# EAGLE board RTK_Mosaic_X5 (EAGLE 9.6.2), part 1 of 2
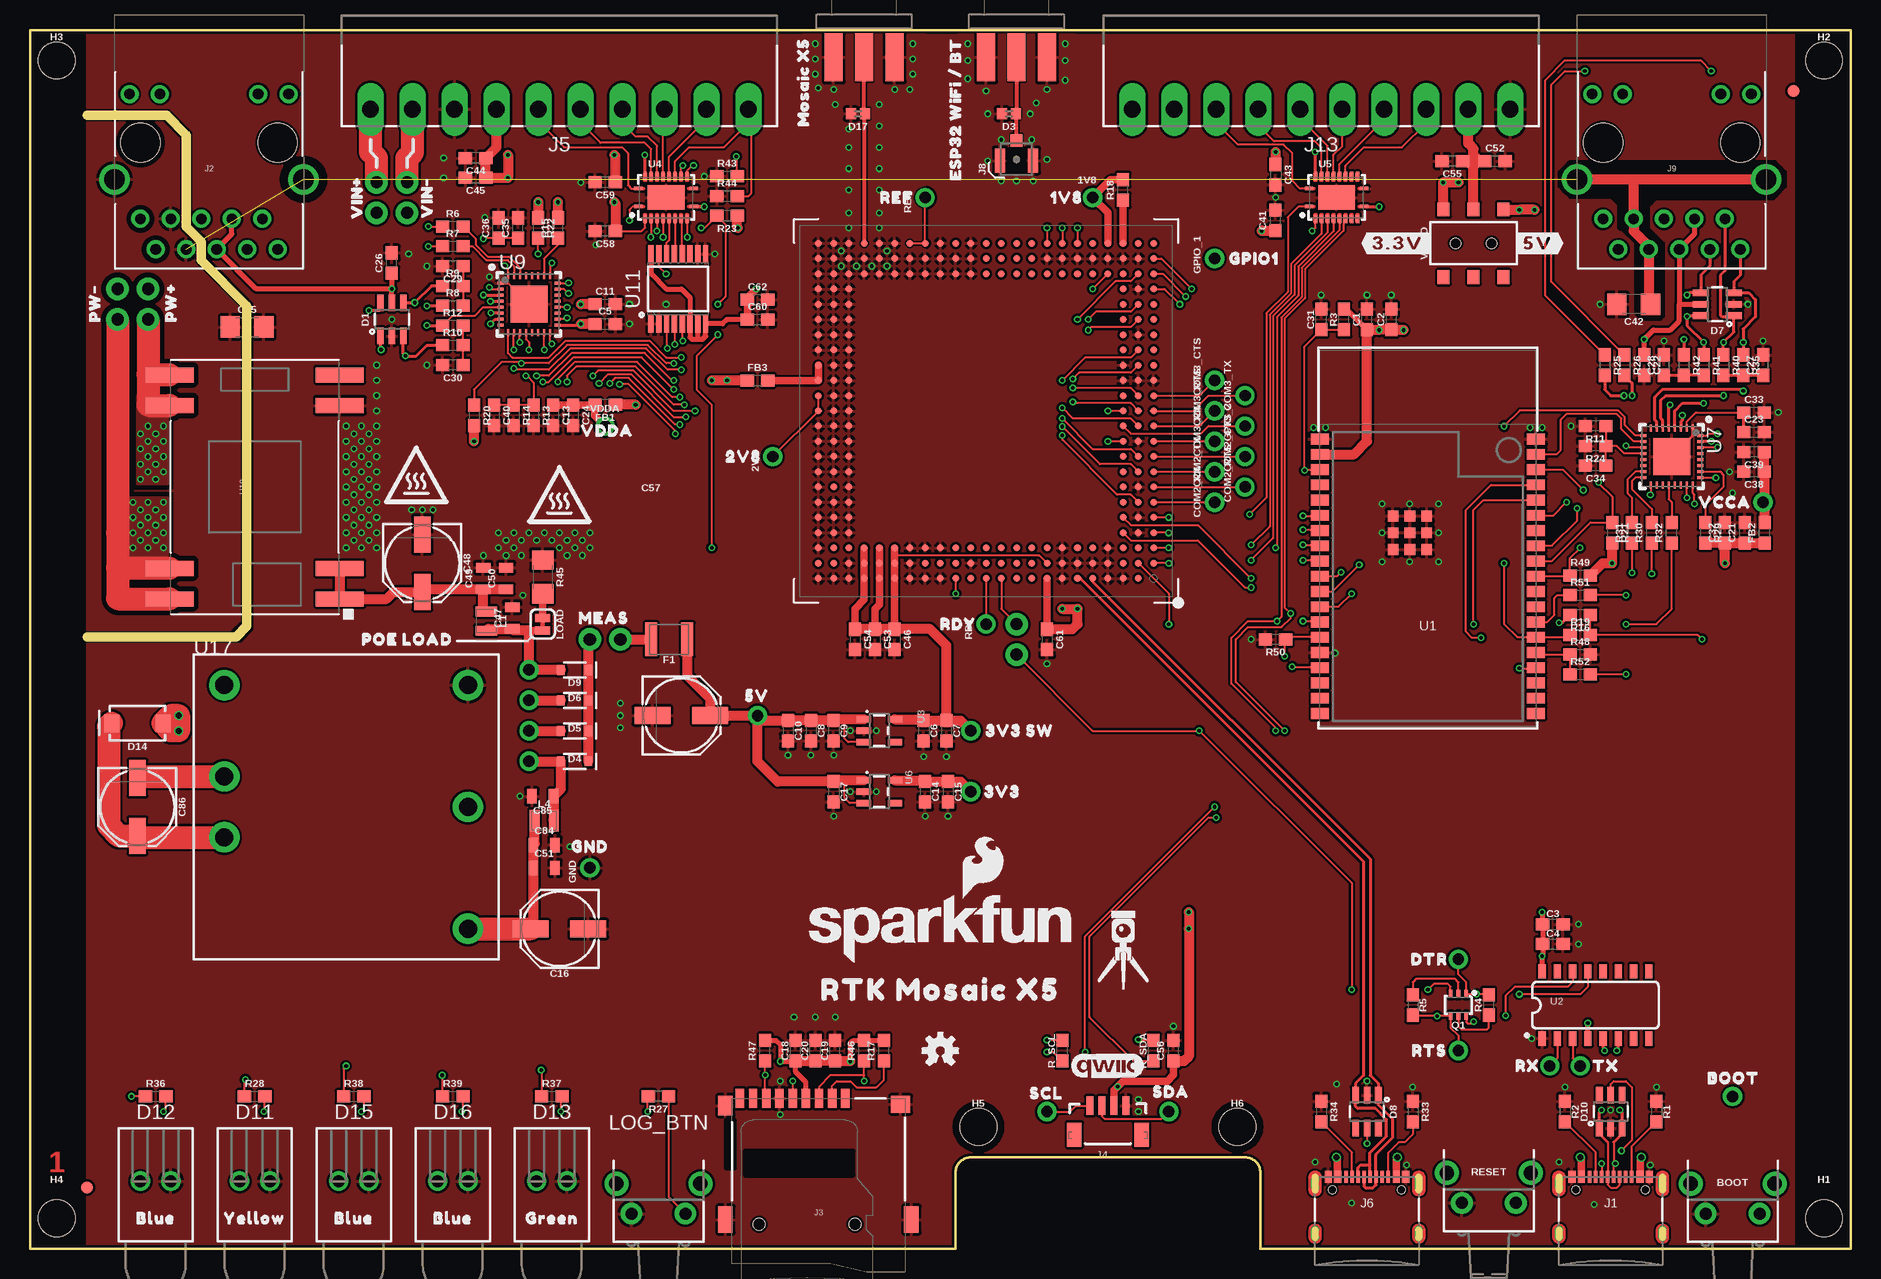
[diagram p2: board, top side]
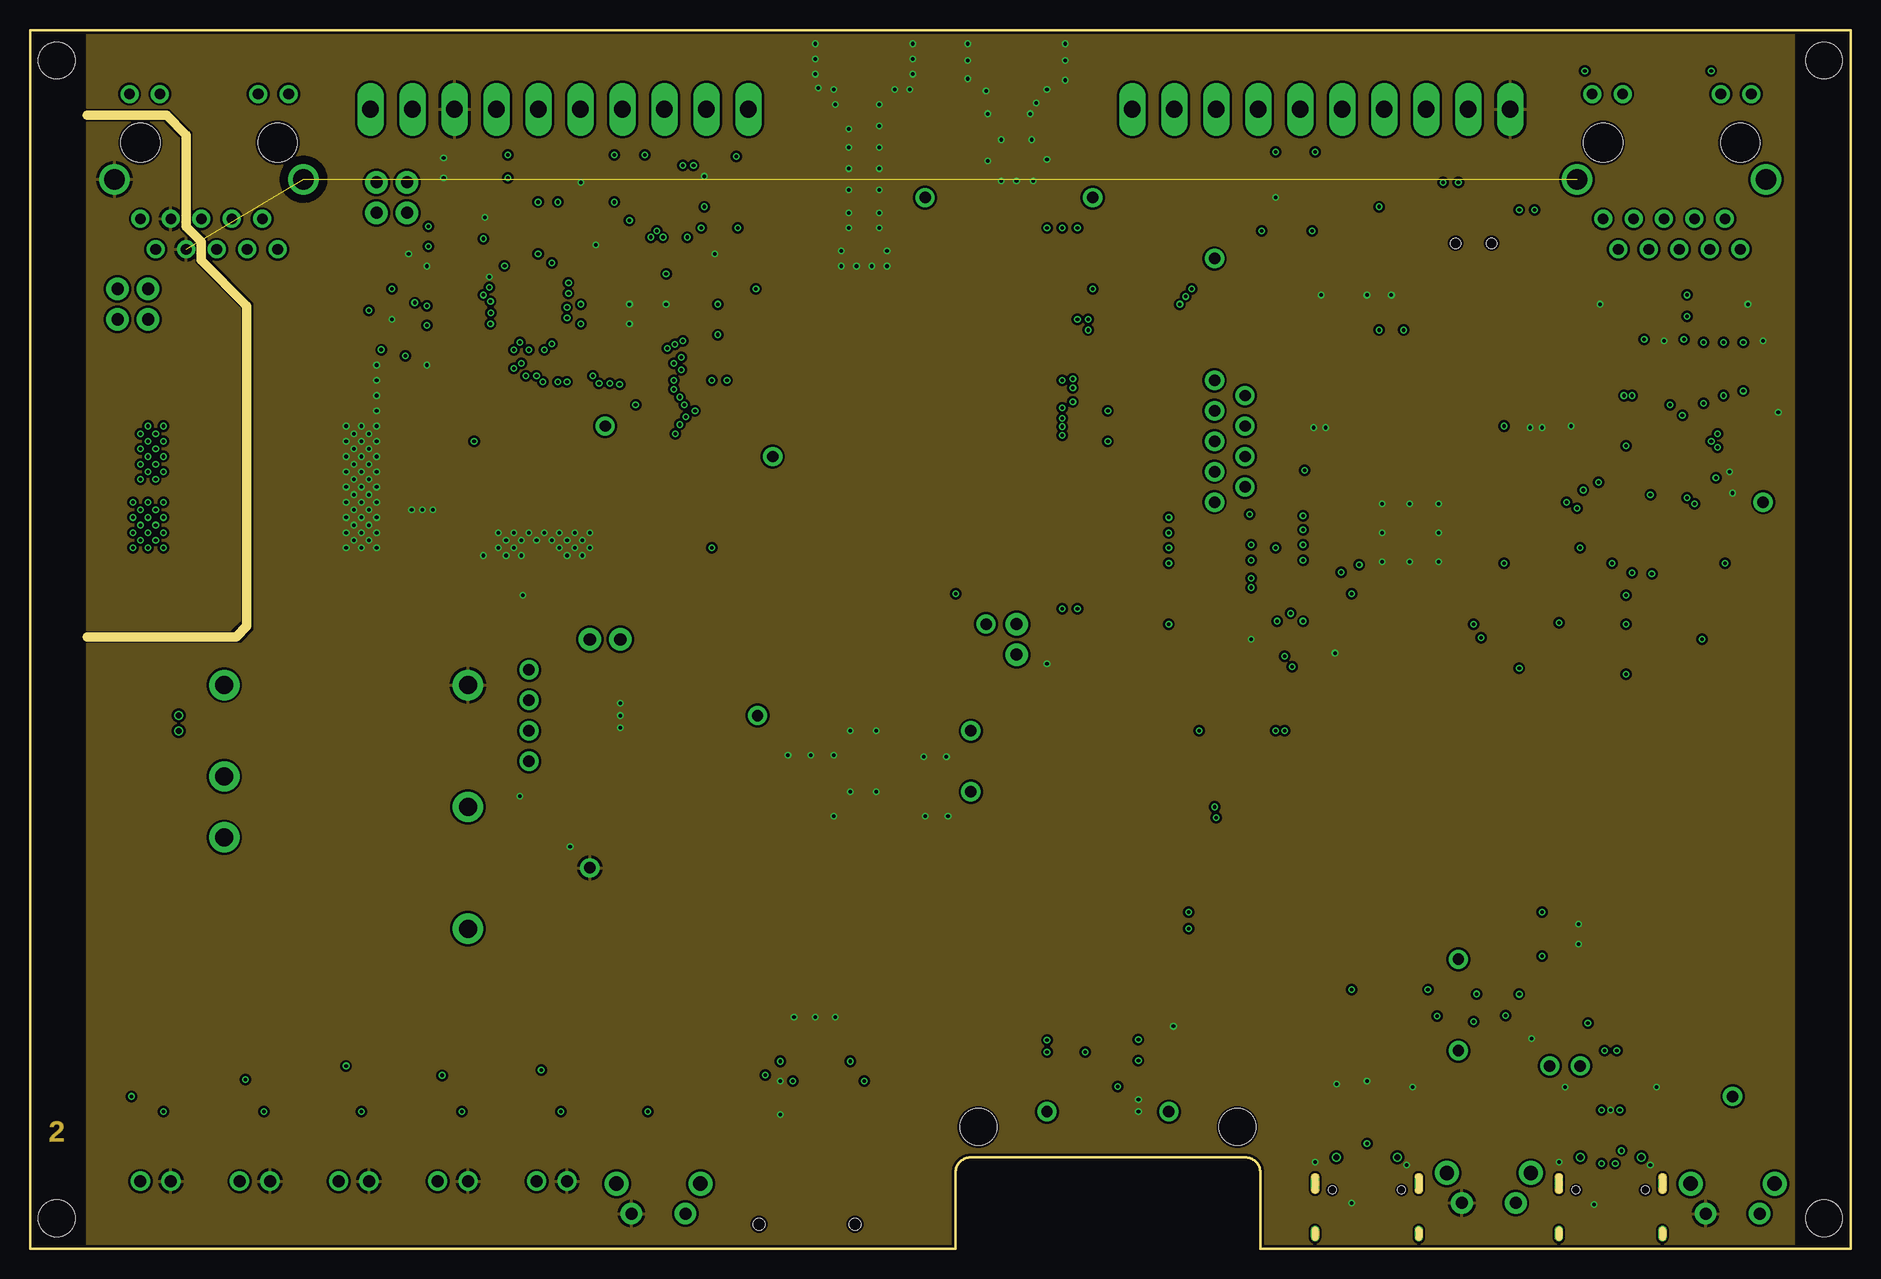
[diagram p3: board, inner layer Route2]
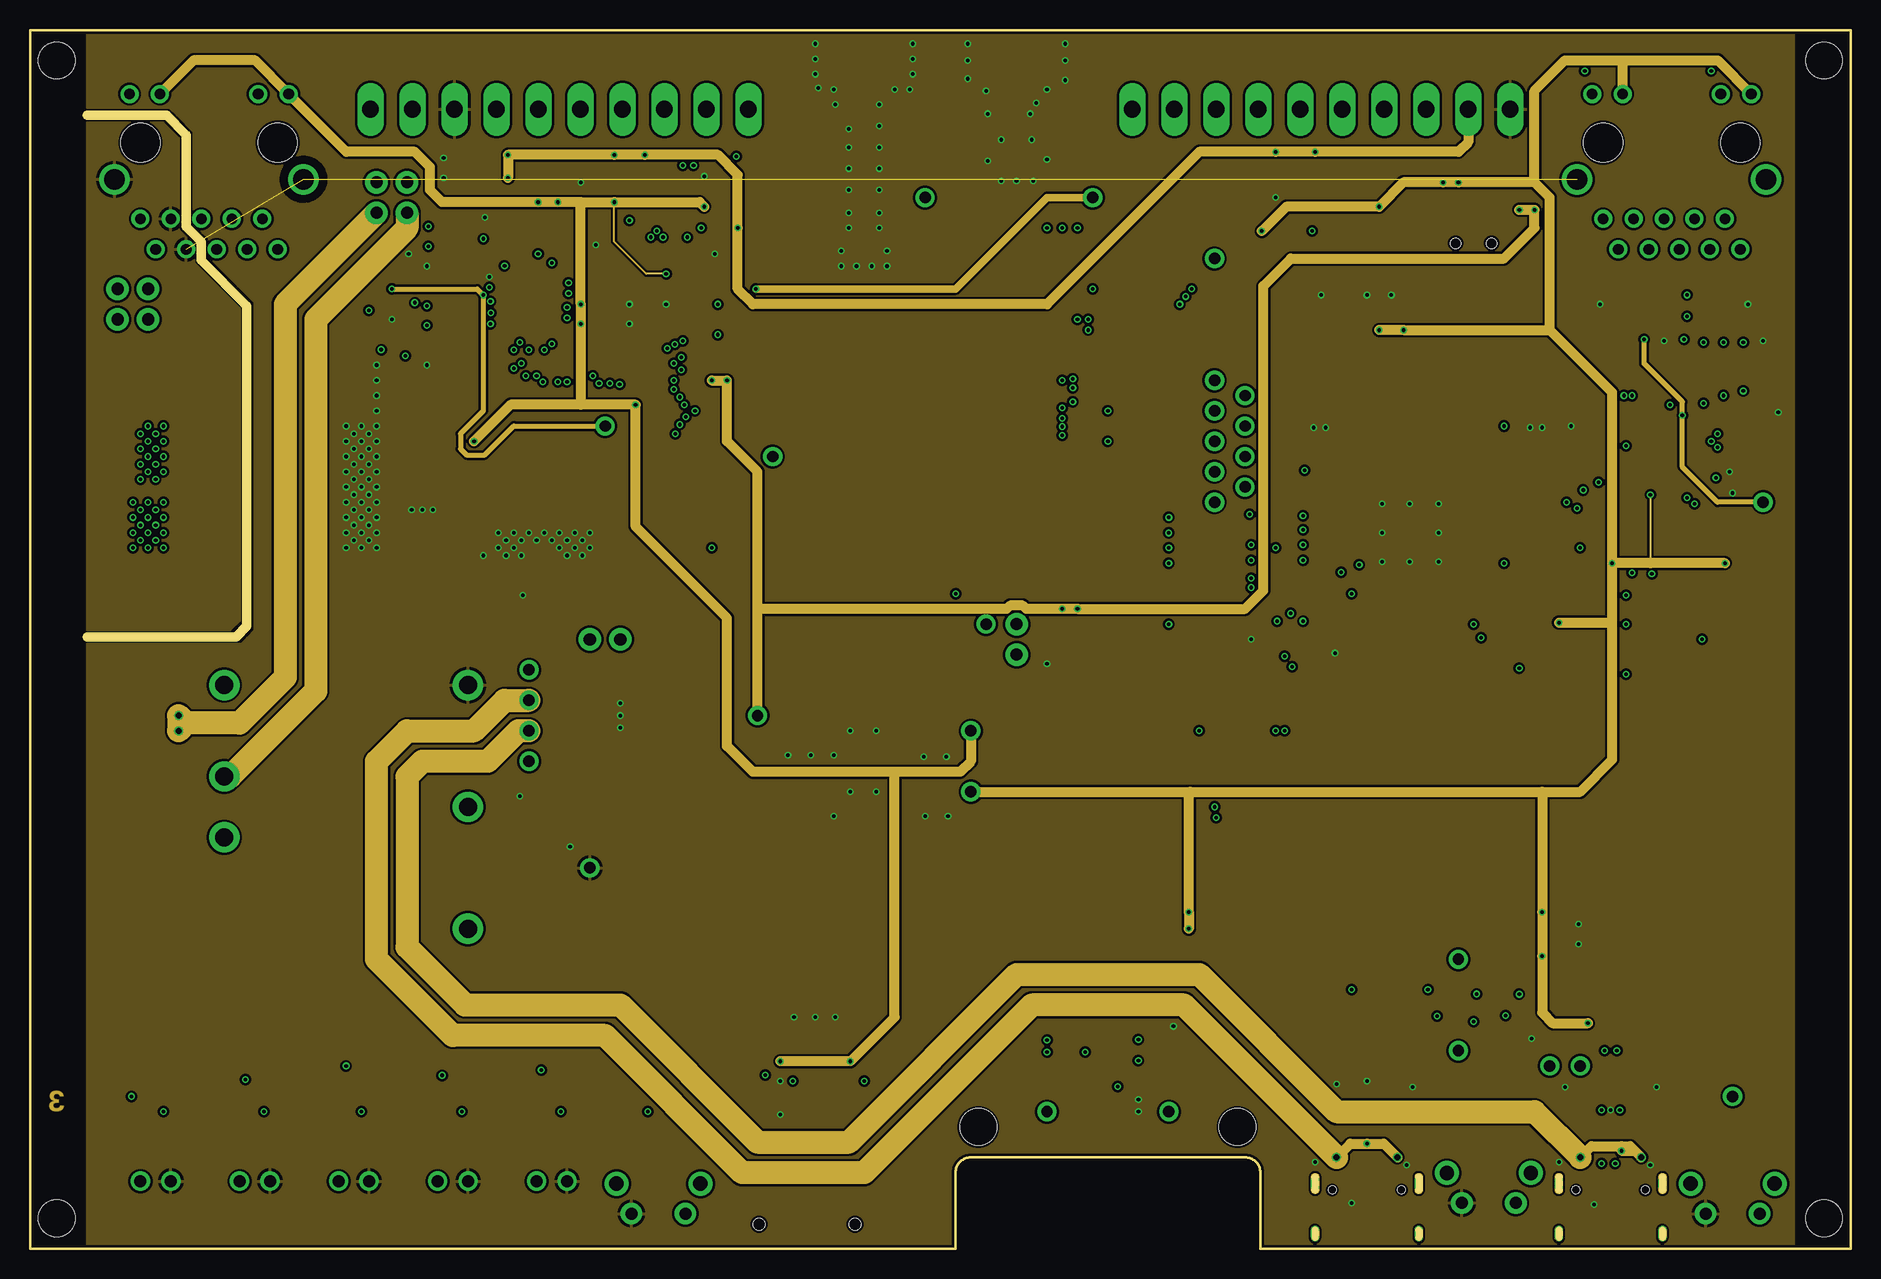
[diagram p4: board, inner layer Route15]
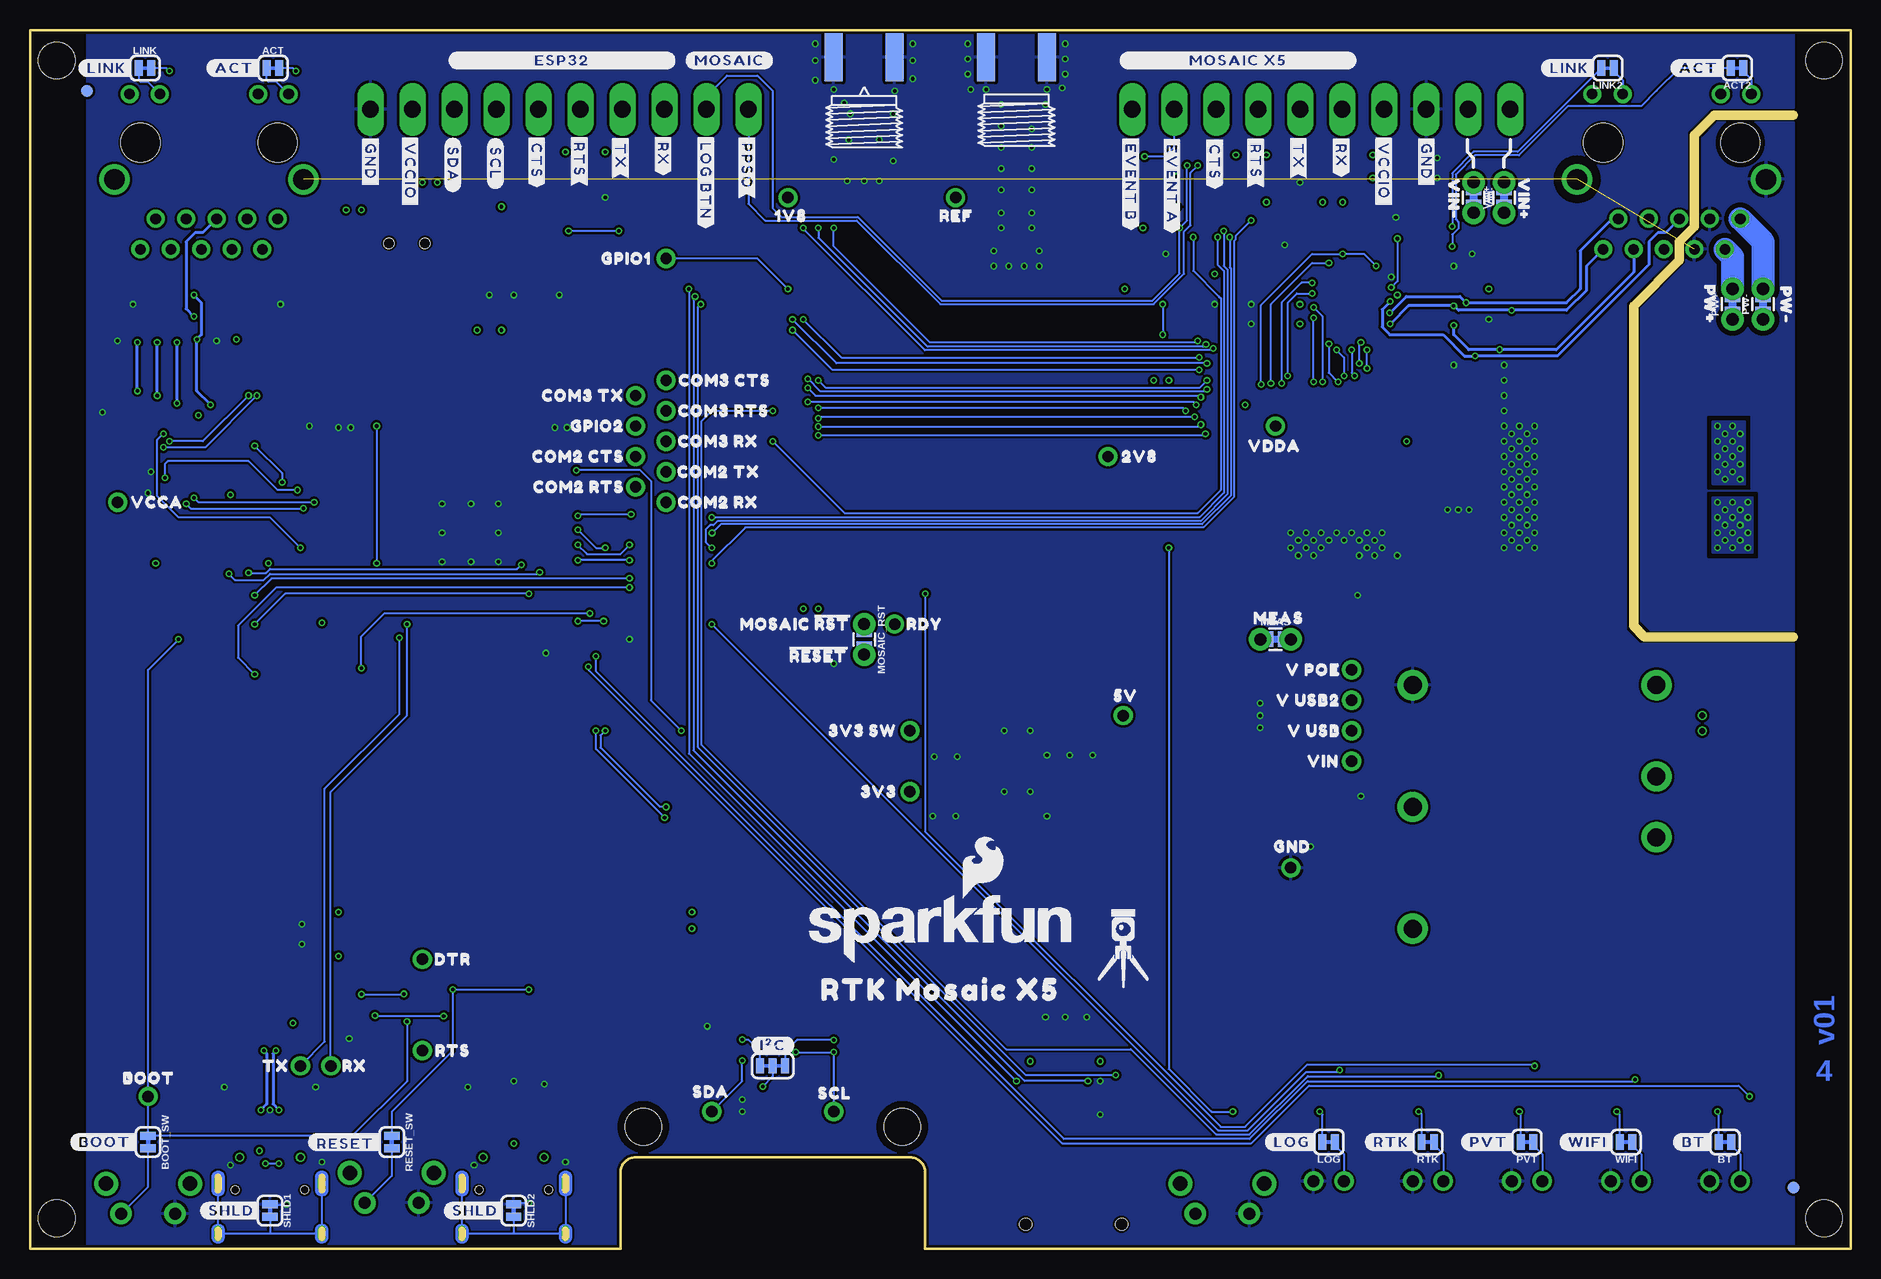
[diagram p5: board, bottom side, seen from below]

Size 151.77 x 101.6 mm. Coordinates in mm from the lower left corner, seen from the top.
Outline: 0,0 77.15,0 77.15,6.35 arc-90 78.42,7.62 101.28,7.62 arc-90 102.55,6.35 102.55,0 151.77,0 151.77,101.6 0,101.6 0,0
Copper layers (1*2*15*16): Top 0.035559375mm / dielectric 0.47751875mm / Route2 0.035559375mm / dielectric 0.47751875mm / Route15 0.035559375mm / dielectric 0.47751875mm / Bottom 0.035559375mm
Design rules "SparkFun-4-Layer-Minimum-JLCPCB": minimum track width 5mil, minimum drill 0.2mm, track to track 5mil, track to pad 5mil, pad to pad 5mil, via to via 5mil, smd to smd 5mil, copper to edge 7mil, drill to drill 7mil, minimum pad ring 5mil, minimum via ring 5mil, stop-mask expansion 2.5mil, vias tented up to drill 25mil, thermal gap 10mil
Net classes: 2 3.3V: width 0.508 mm; 3 RF_IN: width 0.35 mm, clearance 0.46 mm; 4 USB: width 0.203 mm, clearance 0.127 mm; 7 V_ZED: width 0.2 mm, clearance 0.2 mm; 8 V_RF: width 0.2 mm; 11 ZED_DIG: width 0.1 mm, clearance 0.1 mm
tKeepout: area 0,6.3 to 4.8,95.2; area 147,6.3 to 151.8,95.2
Milling: 9 lines

## Footprints (pad centres in the part's own frame; a part is rotated, then mirrored left to right if it is on the bottom)
1X01_NO_SILK = drill 0.95 pad 1.6: 1 0,0
SMT-JUMPER_2_NC_TRACE_SILK = smd 0.66 x 1.27: 1 -0.521,0; 2 0.521,0
TACTILE_SWITCH_PTH_RA_8-020 = drill 1 pad 1.8: 1 -2.25,0; 2 2.25,0 | drill 1.2 pad 2: M1 -3.5,2.5; M2 3.5,2.5
0603 = smd 1.1 x 1: 1 -0.85,0; 2 0.85,0
PANASONIC_D = smd 3 x 1.4: + 2.4,0; - -2.4,0
1206 = smd 1.6 x 1.8: 1 -1.4,0; 2 1.4,0
0805 = smd 0.8 x 1.2: 1 -0.9,0; 2 0.9,0
SOT-23-6 = smd 0.55 x 1.35: 1 -0.95,-1.375; 2 0,-1.375; 3 0.95,-1.375; 4 0.95,1.375; 5 0,1.375; 6 -0.95,1.375
0402 = smd 0.85 x 0.9: 1 -0.58,0; 2 0.58,0
SOD-323 = smd 0.63 x 0.83: A 1.15,0; C -1.15,0
CBI-RIGHT-ANGLE-PTH = drill 1 pad 1.6: A -1.27,5; C 1.27,5
SMA-DIODE = smd 1.27 x 1.47: A -2.15,0; C 2.15,0
RP-SMA-EDGE = smd 1.5 x 4: GND@0 -2.54,0; GND@1 2.54,0; SIG 0,0 | smd 1.5 x 4 bottom: GND@2 -2.54,0; GND@3 2.54,0
1210 = smd 1 x 2.8: 1 -1.5,0; 2 1.5,0
FIDUCIAL-1X2 = smd 1 x 1: 1 0,0
STAND-OFF-TIGHT = hole 3.048: 0,0
SMT-JUMPER_3_2-NC_TRACE_SILK = smd 0.66 x 1.27: 1 -1.041,0; 2 0,0; 3 1.041,0
USB-C-16P_4LAYER-PADS = smd 0.3 x 1: A5 -1.25,-0.34; A6 -0.25,-0.34; A7 0.25,-0.34; A8 1.25,-0.34; B5 1.75,-0.34; B6 0.75,-0.34; B7 -0.75,-0.34; B8 -1.75,-0.34 | smd 0.6 x 1: GND -3.225,-0.34; GND2 3.225,-0.34; VBUS1 -2.45,-0.34; VBUS2 2.45,-0.34 | drill 0.4 pad 0.6 long: SHLD1 -4.318,-0.915; SHLD2 4.318,-0.915; SHLD3 -4.318,-5.095; SHLD4 4.318,-5.095 | hole 0.65: -2.89,-1.445; 2.89,-1.445
MAGJACK-SYM_LED = drill 0.9 pad 1.5: 1 -5.715,8.89; 2 -4.445,6.35; 3 -3.175,8.89; 4 -1.905,6.35; 5 -0.635,8.89; 6 0.635,6.35; 7 1.905,8.89; 8 3.175,6.35; 9 4.445,8.89; 10 5.715,6.35; 11 -6.63,-4.06; 12 -4.09,-4.06; 13 4.09,-4.06; 14 6.63,-4.06 | drill 1.7 pad 2.4: S1 -7.875,3.05; S2 7.875,3.05 | hole 3.25: -5.715,0; 5.715,0
MICROSD-EXTERNALPIN = smd 0.7 x 1.6: 1 2.25,10.5; 2 1.15,10.5; 3 0.05,10.5; 4 -1.05,10.5; 5 -2.15,10.5; 6 -3.25,10.5; 7 -4.35,10.5; 8 -5.45,10.5; 9 -6.55,10.5 | smd 1.2 x 1.6: 10 -7.75,9.9 | smd 1.2 x 2.2: 11 -7.75,0.4; 12 7.75,0.4 | smd 1.6 x 1.4: 13 6.85,10 | hole 1: 3.05,0; -4.95,0
JST04_1MM_VERT = smd 0.6 x 1.55: 1 -1.5,0.775; 2 -0.5,0.775; 3 0.5,0.775; 4 1.5,0.775 | smd 1.2 x 2: NC1 -2.8,3.2; NC2 2.8,3.2
1X10_SCREW_TERMINAL_3.5MM = drill 1.4 pad 2.2 long: 1 -15.75,2.8; 2 -12.25,2.8; 3 -8.75,2.8; 4 -5.25,2.8; 5 -1.75,2.8; 6 1.75,2.8; 7 5.25,2.8; 8 8.75,2.8; 9 12.25,2.8; 10 15.75,2.8
U.FL_REDUCED_FOOTPRINT = smd 2 x 0.85: 1 -0.1,1.375; 2 -0.1,-1.375 | smd 1.05 x 1: FEED 1.575,0
0805-WIDE = smd 0.8 x 1.8: 1 -0.8,0; 2 0.8,0
COMBO-JUMPER_2_NC_TRACE = smd 0.635 x 1.27: 1 -0.508,0; 2 0.508,0 | drill 1.016 pad 1.88: 3 -1.27,0; 4 1.27,0
SMA-EDGE = smd 1.5 x 4: GND@0 -2.54,0; GND@1 2.54,0; SIG 0,0 | smd 1.5 x 4 bottom: GND@2 -2.54,0; GND@3 2.54,0
COMBO-JUMPER_2_NO = smd 0.635 x 1.27: 1 -0.508,0; 2 0.508,0 | drill 1.016 pad 1.88: 3 -1.27,0; 4 1.27,0
SC70-6 = smd 0.3 x 0.66: 1 -0.65,-0.92; 2 0,-0.92; 3 0.65,-0.92; 4 0.65,0.92; 5 0,0.92; 6 -0.65,0.92
ESP32-WROVER-E/IE = smd 0.9 x 1.5: 1 7.8,9; 2 6.53,9; 3 5.26,9; 4 3.99,9; 5 2.72,9; 6 1.45,9; 7 0.18,9; 8 -1.09,9; 9 -2.36,9; 10 -3.63,9; 11 -4.9,9; 12 -6.17,9; 13 -7.44,9; 14 -8.71,9; 15 -9.98,9; 16 -11.25,9; 17 -12.52,9; 18 -13.79,9; 19 -15.06,9; 20 -15.06,-9; 21 -13.79,-9; 22 -12.52,-9; 23 -11.25,-9; 24 -9.98,-9; 25 -8.71,-9; 26 -7.44,-9; 27 -6.17,-9; 28 -4.9,-9; 29 -3.63,-9; 30 -2.36,-9; 31 -1.09,-9; 32 0.18,-9; 33 1.45,-9; 34 2.72,-9; 35 3.99,-9; 36 5.26,-9; 37 6.53,-9; 38 7.8,-9 | smd 0.9 x 0.9: GND 0,1.5; GNDT1 -1.4,2.9; GNDT2 -1.4,1.5; GNDT3 -1.4,0.1; GNDT4 0,0.1; GNDT5 1.4,0.1; GNDT6 1.4,1.5; GNDT7 1.4,2.9; GNDT8 0,2.9
SO016 = smd 0.6 x 1.2: 1 -4.445,-2.8; 2 -3.175,-2.8; 3 -1.905,-2.8; 4 -0.635,-2.8; 5 0.635,-2.8; 6 1.905,-2.8; 7 3.175,-2.8; 8 4.445,-2.8; 9 4.445,2.8; 10 3.175,2.8; 11 1.905,2.8; 12 0.635,2.8; 13 -0.635,2.8; 14 -1.905,2.8; 15 -3.175,2.8; 16 -4.445,2.8
SOT23-5 = smd 0.55 x 1.2: 1 -0.95,-1.3; 2 0,-1.3; 3 0.95,-1.3; 4 0.95,1.3; 5 -0.95,1.3
VFQFN-20 = smd 0.7 x 0.28: 1 -2.3,-0.75; 10 2.3,-0.75; 11 2.3,0.75; 20 -2.3,0.75 | smd 0.28 x 0.7: 2 -1.75,-1.8; 3 -1.25,-1.8; 4 -0.75,-1.8; 5 -0.25,-1.8; 6 0.25,-1.8; 7 0.75,-1.8; 8 1.25,-1.8; 9 1.75,-1.8; 12 1.75,1.8; 13 1.25,1.8; 14 0.75,1.8; 15 0.25,1.8; 16 -0.25,1.8; 17 -0.75,1.8; 18 -1.25,1.8; 19 -1.75,1.8 | smd 3.05 x 2.05: EPAD 0,0
MLF55Q-32LD = smd 0.55 x 0.23: 1 -2.375,1.75; 2 -2.375,1.25; 3 -2.375,0.75; 4 -2.375,0.25; 5 -2.375,-0.25; 6 -2.375,-0.75; 7 -2.375,-1.25; 8 -2.375,-1.75; 17 2.375,-1.75; 18 2.375,-0.25; 19 2.375,-0.75; 20 2.375,-1.25; 21 2.375,0.25; 22 2.375,0.75; 23 2.375,1.25; 24 2.375,1.75 | smd 0.23 x 0.55: 9 -1.75,-2.375; 10 -0.25,-2.375; 11 -0.75,-2.375; 12 -1.25,-2.375; 13 0.25,-2.375; 14 0.75,-2.375; 15 1.25,-2.375; 16 1.75,-2.375; 25 1.75,2.375; 26 0.25,2.375; 27 0.75,2.375; 28 1.25,2.375; 29 -0.25,2.375; 30 -0.75,2.375; 31 -1.25,2.375; 32 -1.75,2.375 | smd 3.1 x 3.1: GND 0,0
MOSAIC_LGA = smd 0.6 x 0.6: A2 13.97,12.7; A3 13.97,11.43; A4 13.97,10.16; A5 13.97,8.89; A6 13.97,7.62; A7 13.97,6.35; A8 13.97,5.08; A9 13.97,3.81; A10 13.97,2.54; A11 13.97,1.27; A12 13.97,0; A13 13.97,-1.27; A14 13.97,-2.54; A15 13.97,-3.81; A16 13.97,-5.08; A17 13.97,-6.35; A18 13.97,-7.62; A19 13.97,-8.89; A20 13.97,-10.16; A21 13.97,-11.43; A22 13.97,-12.7; A23 13.97,-13.97; AA1 -11.43,13.97; AA2 -11.43,12.7; AA3 -11.43,11.43; AA4 -11.43,10.16; AA5 -11.43,8.89; AA6 -11.43,7.62; AA7 -11.43,6.35; AA8 -11.43,5.08; AA9 -11.43,3.81; AA10 -11.43,2.54; AA11 -11.43,1.27; AA12 -11.43,0; AA13 -11.43,-1.27; AA14 -11.43,-2.54; AA15 -11.43,-3.81; AA16 -11.43,-5.08; AA17 -11.43,-6.35; AA18 -11.43,-7.62; AA19 -11.43,-8.89; AA20 -11.43,-10.16; AA21 -11.43,-11.43; AA22 -11.43,-12.7; AA23 -11.43,-13.97; AB1 -12.7,13.97; AB2 -12.7,12.7; AB3 -12.7,11.43; AB4 -12.7,10.16; AB5 -12.7,8.89; AB6 -12.7,7.62; AB7 -12.7,6.35; AB8 -12.7,5.08; AB9 -12.7,3.81; AB10 -12.7,2.54; AB11 -12.7,1.27; AB12 -12.7,0; AB13 -12.7,-1.27; AB14 -12.7,-2.54; AB15 -12.7,-3.81; AB16 -12.7,-5.08; AB17 -12.7,-6.35; AB18 -12.7,-7.62; AB19 -12.7,-8.89; AB20 -12.7,-10.16; AB21 -12.7,-11.43; AB22 -12.7,-12.7; AB23 -12.7,-13.97; AC1 -13.97,13.97; AC2 -13.97,12.7; AC3 -13.97,11.43; AC4 -13.97,10.16; AC5 -13.97,8.89; AC6 -13.97,7.62; AC7 -13.97,6.35; AC8 -13.97,5.08; AC9 -13.97,3.81; AC10 -13.97,2.54; AC11 -13.97,1.27; AC12 -13.97,0; AC13 -13.97,-1.27; AC14 -13.97,-2.54; AC15 -13.97,-3.81; AC16 -13.97,-5.08; AC17 -13.97,-6.35; AC18 -13.97,-7.62; AC19 -13.97,-8.89; AC20 -13.97,-10.16; AC21 -13.97,-11.43; AC22 -13.97,-12.7; AC23 -13.97,-13.97; B1 12.7,13.97; B2 12.7,12.7; B3 12.7,11.43; B4 12.7,10.16; B5 12.7,8.89; B6 12.7,7.62; B7 12.7,6.35; B8 12.7,5.08; B9 12.7,3.81; B10 12.7,2.54; B11 12.7,1.27; B12 12.7,0; B13 12.7,-1.27; B14 12.7,-2.54; B15 12.7,-3.81; B16 12.7,-5.08; B17 12.7,-6.35; B18 12.7,-7.62; B19 12.7,-8.89; B20 12.7,-10.16; B21 12.7,-11.43; B22 12.7,-12.7; B23 12.7,-13.97; C1 11.43,13.97; C2 11.43,12.7; C3 11.43,11.43; C4 11.43,10.16; C5 11.43,8.89; C6 11.43,7.62; C7 11.43,6.35; C8 11.43,5.08; C9 11.43,3.81; C10 11.43,2.54; C11 11.43,1.27; C12 11.43,0; C13 11.43,-1.27; C14 11.43,-2.54; C15 11.43,-3.81; C16 11.43,-5.08; C17 11.43,-6.35; C18 11.43,-7.62; C19 11.43,-8.89; C20 11.43,-10.16; C21 11.43,-11.43; C22 11.43,-12.7; C23 11.43,-13.97; D1 10.16,13.97; D2 10.16,12.7; D3 10.16,11.43; D21 10.16,-11.43; D22 10.16,-12.7; D23 10.16,-13.97; E1 8.89,13.97; E2 8.89,12.7; E3 8.89,11.43; E21 8.89,-11.43; E22 8.89,-12.7; E23 8.89,-13.97; F1 7.62,13.97; F2 7.62,12.7; F3 7.62,11.43; F21 7.62,-11.43; F22 7.62,-12.7; F23 7.62,-13.97; G1 6.35,13.97; G2 6.35,12.7; G3 6.35,11.43; G21 6.35,-11.43; G22 6.35,-12.7; G23 6.35,-13.97; H1 5.08,13.97; H2 5.08,12.7; H3 5.08,11.43; H21 5.08,-11.43; H22 5.08,-12.7; H23 5.08,-13.97; J1 3.81,13.97; J2 3.81,12.7; J3 3.81,11.43; J21 3.81,-11.43; J22 3.81,-12.7; J23 3.81,-13.97; K1 2.54,13.97; K2 2.54,12.7; K3 2.54,11.43; K21 2.54,-11.43; K22 2.54,-12.7; K23 2.54,-13.97; L1 1.27,13.97; L2 1.27,12.7; L3 1.27,11.43; L21 1.27,-11.43; L22 1.27,-12.7; L23 1.27,-13.97; M1 0,13.97; M2 0,12.7; M3 0,11.43; M21 0,-11.43; M22 0,-12.7; M23 0,-13.97; N1 -1.27,13.97; N2 -1.27,12.7; N3 -1.27,11.43; N21 -1.27,-11.43; N22 -1.27,-12.7; N23 -1.27,-13.97; P1 -2.54,13.97; P2 -2.54,12.7; P3 -2.54,11.43; P21 -2.54,-11.43; P22 -2.54,-12.7; P23 -2.54,-13.97; R1 -3.81,13.97; R2 -3.81,12.7; R3 -3.81,11.43; R21 -3.81,-11.43; R22 -3.81,-12.7; R23 -3.81,-13.97; T1 -5.08,13.97; T2 -5.08,12.7; T3 -5.08,11.43; T21 -5.08,-11.43; T22 -5.08,-12.7; T23 -5.08,-13.97; U1 -6.35,13.97; U2 -6.35,12.7; U3 -6.35,11.43; U21 -6.35,-11.43; U22 -6.35,-12.7; U23 -6.35,-13.97; V1 -7.62,13.97; V2 -7.62,12.7; V3 -7.62,11.43; V21 -7.62,-11.43; V22 -7.62,-12.7; V23 -7.62,-13.97; W1 -8.89,13.97; W2 -8.89,12.7; W3 -8.89,11.43; W21 -8.89,-11.43; W22 -8.89,-12.7; W23 -8.89,-13.97; Y1 -10.16,13.97; Y2 -10.16,12.7; Y3 -10.16,11.43; Y21 -10.16,-11.43; Y22 -10.16,-12.7; Y23 -10.16,-13.97
DP990X = smd 1.25 x 4: 1 -9.33,-7.1; 2 -6.79,-7.1; 3 6.79,-7.1; 4 9.33,-7.1; 5 9.33,7.1; 6 6.79,7.1; 7 -6.79,7.1; 8 -9.33,7.1
SOP65P640X120-16N = smd 1.5 x 0.45: 1 -2.9,2.275; 2 -2.9,1.625; 3 -2.9,0.975; 4 -2.9,0.325; 5 -2.9,-0.325; 6 -2.9,-0.975; 7 -2.9,-1.625; 8 -2.9,-2.275; 9 2.9,-2.275; 10 2.9,-1.625; 11 2.9,-0.975; 12 2.9,-0.325; 13 2.9,0.325; 14 2.9,0.975; 15 2.9,1.625; 16 2.9,2.275
URB_YMD-15WR3 = drill 1.499 pad 2.54: 1 -10.16,10.16; 2 -10.16,2.54; 3 -10.16,-2.54; 4 10.16,-10.16; 5 10.16,0; 6 10.16,10.16
SWITCH_DPDT_SMD_AYZ0202 = smd 1 x 1.15: 1 -2.5,2.825; 2 0,2.825; 3 2.5,2.825; 4 -2.5,-2.825; 5 0,-2.825; 6 2.5,-2.825 | hole 0.85: 1.5,0; -1.5,0

## Placement (x,y rotation side)
1V8  TEST-POINTPOGO_PTH  [1X01_NO_SILK]  88.58,87.63 0 top
2V8  TEST-POINTPOGO_PTH  [1X01_NO_SILK]  61.91,66.04 90 top
3V3  TEST-POINTPOGO_PTH  [1X01_NO_SILK]  78.42,38.1 0 top
3V3_SW  TEST-POINTPOGO_PTH  [1X01_NO_SILK]  78.42,43.18 0 top
5V  TEST-POINTPOGO_PTH  [1X01_NO_SILK]  60.64,44.45 0 top
ACT  JUMPER-SMT_2_NC_TRACE_SILK  [SMT-JUMPER_2_NC_TRACE_SILK]  131.51,98.42 0 bottom
ACT2  JUMPER-SMT_2_NC_TRACE_SILK  [SMT-JUMPER_2_NC_TRACE_SILK]  9.46,98.42 180 bottom
BOOT  MOMENTARY-SWITCH-SPST-PTH-RIGHT-ANGLE-8-020  [TACTILE_SWITCH_PTH_RA_8-020]  141.92,2.92 0 top
BOOT_SW  JUMPER-SMT_2_NC_TRACE_SILK  [SMT-JUMPER_2_NC_TRACE_SILK]  141.92,8.89 270 bottom
BT  JUMPER-SMT_2_NC_TRACE_SILK  [SMT-JUMPER_2_NC_TRACE_SILK]  10.48,8.89 180 bottom
C1  2.2uF  [0603]  111.44,77.47 90 top
C2  0.1uF  [0603]  113.47,77.47 90 top
C3  2.2uF  [0603]  126.94,27.05 0 top
C4  10nF  [0603]  126.94,25.4 0 top
C5  0.1uF  [0603]  47.94,77.09 0 top
C6  2.2uF  [0603]  74.49,43.18 270 top
C7  0.1uF  [0603]  76.39,43.18 270 top
C8  2.2uF  [0603]  65.09,43.18 270 top
C9  2.2uF  [0603]  66.99,43.18 270 top
C10  2.2uF  [0603]  63.18,43.18 270 top
C11  10uF  [0603]  47.94,78.74 0 top
C13  0.1uF  [0603]  43.62,69.47 270 top
C14  2.2uF  [0603]  74.61,38.1 270 top
C15  0.1uF  [0603]  76.52,38.1 270 top
C16  100uF  [PANASONIC_D]  44.13,26.67 180 top
C17  0.1uF  [0603]  66.99,38.1 270 top
C18  2.2uF  [0603]  63.82,16.51 90 top
C19  0.1uF  [0603]  67.12,16.51 90 top
C20  10uF  [0603]  65.47,16.51 90 top
C21  0.1uF  [0603]  142.94,59.69 90 top
C22  0.1uF  [0603]  134.56,73.66 270 top
C23  0.1uF  [0603]  143.7,68.07 0 top
C24  10uF  [0603]  45.28,69.47 270 top
C25  1nF  [1206]  18.1,76.83 0 top
C26  0.1uF  [0603]  30.16,82.17 90 top
C27  0.1uF  [0603]  144.46,73.66 90 top
C28  0.1uF  [0603]  136.21,73.66 90 top
C29  0.1uF  [0603]  35.24,81.92 180 top
C30  0.1uF  [0603]  35.24,73.66 180 top
C31  0.1uF  [0603]  107.63,77.47 90 top
C32  10uF  [0603]  141.29,59.69 90 top
C33  2.2uF  [0603]  143.7,69.72 0 top
C34  100pF  [0603]  130.49,65.28 180 top
C35  0.1uF  [0603]  40.7,85.09 90 top
C36  2.2uF  [0603]  39.05,85.09 90 top
C38  0.1uF  [0603]  143.7,64.77 180 top
C39  10uF  [0603]  143.7,66.42 180 top
C40  100pF  [0603]  38.67,69.47 270 top
C41  0.1uF  [0603]  103.82,85.72 90 top
C42  1nF  [1206]  133.68,78.74 180 top
C43  0.1uF  [0603]  103.82,89.53 270 top
C44  0.1uF  [0603]  37.15,90.93 180 top
C45  10uF  [0603]  37.15,89.28 180 top
C46  2.2uF  [0603]  72.07,50.8 270 top
C47  10uF  [0805]  40.2,52.58 90 top
C48  100uF  [PANASONIC_D]  32.7,57.15 270 top
C49  10uF  [0805]  37.78,55.88 90 top
C50  10uF  [0805]  39.69,55.88 90 top
C51  10uF  [0805]  42.86,31.75 0 top
C52  0.1uF  [0603]  122.11,90.68 0 top
C53  0.1uF  [0603]  70.42,50.8 270 top
C54  10uF  [0603]  68.77,50.8 270 top
C55  10uF  [0603]  118.55,90.68 180 top
C56  2.2uF  [0603]  95.31,16.51 90 top
C57  100uF  [PANASONIC_D]  54.29,44.45 0 top
C58  0.1uF  [0603]  47.94,84.84 180 top
C59  0.1uF  [0603]  47.94,88.9 180 top
C60  2.2uF  [0603]  60.64,77.47 0 top
C61  2.2uF  [0603]  84.77,50.8 270 top
C62  0.1uF  [0603]  60.64,79.12 0 top
C84  10uF  [0805]  42.86,33.66 0 top
C85  10uF  [0805]  42.74,37.72 180 top
C86  47UF  [PANASONIC_D]  8.95,36.83 270 top
COM2_CTS  TEST-POINTPOGO_PTH  [1X01_NO_SILK]  101.28,66.04 90 top
COM2_RTS  TEST-POINTPOGO_PTH  [1X01_NO_SILK]  101.28,63.5 90 top
COM2_RX  TEST-POINTPOGO_PTH  [1X01_NO_SILK]  98.74,62.23 90 top
COM2_TX  TEST-POINTPOGO_PTH  [1X01_NO_SILK]  98.74,64.77 90 top
COM3_CTS  TEST-POINTPOGO_PTH  [1X01_NO_SILK]  98.74,72.39 90 top
COM3_RTS  TEST-POINTPOGO_PTH  [1X01_NO_SILK]  98.74,69.85 90 top
COM3_RX  TEST-POINTPOGO_PTH  [1X01_NO_SILK]  98.74,67.31 90 top
COM3_TX  TEST-POINTPOGO_PTH  [1X01_NO_SILK]  101.28,71.12 90 top
D1  ESD Diode  [SOT-23-6]  30.16,77.47 0 top
D3  PESD0402  [0402]  81.6,94.61 180 top
D4  3A/10V/280mV  [SOD-323]  45.4,40.64 180 top
D5  3A/10V/280mV  [SOD-323]  45.4,43.18 180 top
D6  3A/10V/280mV  [SOD-323]  45.4,45.72 180 top
D7  ESD Diode  [SOT-23-6]  140.65,78.74 90 top
D8  ESD Diode  [SOT-23-6]  111.44,11.43 180 top
D9  3A/10V/280mV  [SOD-323]  45.4,48.26 180 top
D10  ESD Diode  [SOT-23-6]  131.76,11.43 0 top
D11  LED-RIGHT-ANGLE-PTH-AMBER  [CBI-RIGHT-ANGLE-PTH]  18.73,0.64 0 top
D12  LED-RIGHT-ANGLE-PTH-BLUE  [CBI-RIGHT-ANGLE-PTH]  10.48,0.64 0 top
D13  LED-RIGHT-ANGLE-PTH-GREEN  [CBI-RIGHT-ANGLE-PTH]  43.5,0.64 0 top
D14  3A/40V  [SMA-DIODE]  8.95,43.81 180 top
D15  LED-RIGHT-ANGLE-PTH-BLUE  [CBI-RIGHT-ANGLE-PTH]  26.99,0.64 0 top
D16  LED-RIGHT-ANGLE-PTH-BLUE  [CBI-RIGHT-ANGLE-PTH]  35.24,0.64 0 top
D17  PESD0402  [0402]  69.02,94.61 180 top
DTR  TEST-POINTPOGO_PTH  [1X01_NO_SILK]  119.06,24.13 0 top
ESP32_RF  ANTENNA-SMA-GROUNDEDEDGE_RPSMA  [RP-SMA-EDGE]  82.23,99.31 0 top
F1  6V/2A  [1210]  53.28,50.8 180 top
FB1  470Ω  [0603]  47.94,70.36 180 top
FB2  470Ω  [0603]  144.59,59.69 90 top
FB3  470Ω  [0603]  60.64,72.39 0 top
FD1  FIDUCIAL1X2  [FIDUCIAL-1X2]  4.76,5.08 0 bottom
FD2  FIDUCIAL1X2  [FIDUCIAL-1X2]  4.76,5.08 0 top
FD3  FIDUCIAL1X2  [FIDUCIAL-1X2]  147,96.52 0 bottom
FD4  FIDUCIAL1X2  [FIDUCIAL-1X2]  147,96.52 0 top
FRAME1  FRAME-LEDGER  [CREATIVE_COMMONS]  185.1,0 0 top  (outside the outline)
FRAME3  FRAME-LEDGERNO_FOOTPRINT  [DUMMY]  185.1,0 0 top  (outside the outline)
GND  TEST-POINTPOGO_PTH  [1X01_NO_SILK]  46.67,31.75 90 top
GPIO_1  TEST-POINTPOGO_PTH  [1X01_NO_SILK]  98.74,82.55 90 top
GPIO_2  TEST-POINTPOGO_PTH  [1X01_NO_SILK]  101.28,68.58 90 top
H1  STAND-OFFTIGHT  [STAND-OFF-TIGHT]  149.54,2.54 0 top
H2  STAND-OFFTIGHT  [STAND-OFF-TIGHT]  149.54,99.06 0 top
H3  STAND-OFFTIGHT  [STAND-OFF-TIGHT]  2.22,99.06 0 top
H4  STAND-OFFTIGHT  [STAND-OFF-TIGHT]  2.22,2.54 0 top
H5  STAND-OFFTIGHT  [STAND-OFF-TIGHT]  79.06,10.16 0 top
H6  STAND-OFFTIGHT  [STAND-OFF-TIGHT]  100.65,10.16 0 top
I2C  JUMPER-SMT_3_2-NC_TRACE_SILK  [SMT-JUMPER_3_2-NC_TRACE_SILK]  89.85,15.24 0 bottom
J1  [USB-C-16P_4LAYER-PADS]  131.76,6.35 0 top
J2  MAGJACK-POE  [MAGJACK-SYM_LED]  14.92,92.2 180 top
J3  MICRO-SD-PUSH-PUSH-EXT-PIN  [MICROSD-EXTERNALPIN]  65.72,2.03 0 top
J4  Vertical Qwiic Connector  [JST04_1MM_VERT]  89.85,12.7 180 top
J5  [1X10_SCREW_TERMINAL_3.5MM]  44.13,97.79 180 top
J6  [USB-C-16P_4LAYER-PADS]  111.44,6.35 0 top
J8  [U.FL_REDUCED_FOOTPRINT]  82.23,90.81 90 top
J9  MAGJACK-POE  [MAGJACK-SYM_LED]  136.84,92.2 180 top
J13  [1X10_SCREW_TERMINAL_3.5MM]  107.63,97.79 180 top
L1  2.2uH  [0805-WIDE]  38.04,52.32 270 top
L4  2.2uH  [0805-WIDE]  42.86,35.69 0 top
LINK  JUMPER-SMT_2_NC_TRACE_SILK  [SMT-JUMPER_2_NC_TRACE_SILK]  142.18,98.42 0 bottom
LINK2  JUMPER-SMT_2_NC_TRACE_SILK  [SMT-JUMPER_2_NC_TRACE_SILK]  20.26,98.42 180 bottom
LOAD  JUMPER-SMT_2_NC_TRACE_SILK  [SMT-JUMPER_2_NC_TRACE_SILK]  42.74,52.07 270 top
LOG  JUMPER-SMT_2_NC_TRACE_SILK  [SMT-JUMPER_2_NC_TRACE_SILK]  43.5,8.89 180 bottom
LOG_BTN  MOMENTARY-SWITCH-SPST-PTH-RIGHT-ANGLE-8-020  [TACTILE_SWITCH_PTH_RA_8-020]  52.39,2.92 0 top
LOGO1  SPECIAL_INSTRUCTIONS-ORDERING  [ORDERING_INSTRUCTIONS]  157.16,60.96 0 top  (outside the outline)
LOGO2  QWIIC_LOGO_6MM  [QWIIC_6MM]  89.85,15.24 0 top
LOGO4  OSHW-LOGOS  [OSHW-LOGO-S]  75.88,16.51 0 top
LOGO5  SFE_LOGO_NAME.2_INCH  [SFE_LOGO_NAME_.2]  75.88,26.67 0 top
LOGO6  SFE_LOGO_FLAME.2_INCH  [SFE_LOGO_FLAME_.2]  79.44,31.75 0 top
LOGO7  SFE_LOGO_NAME.2_INCH  [SFE_LOGO_NAME_.2]  75.88,26.67 0 bottom
LOGO8  SFE_LOGO_FLAME.2_INCH  [SFE_LOGO_FLAME_.2]  72.33,31.75 0 bottom
MEAS  JUMPER-COMBO_2_NC_TRACE  [COMBO-JUMPER_2_NC_TRACE]  47.94,50.8 0 bottom
MOSAIC_RF  ANTENNA-SMA-GROUNDEDEDGE_SMA  [SMA-EDGE]  69.53,99.31 0 top
MOSAIC_RST  JUMPER-COMBO_2_NO  [COMBO-JUMPER_2_NO]  82.23,50.8 270 bottom
PVT  JUMPER-SMT_2_NC_TRACE_SILK  [SMT-JUMPER_2_NC_TRACE_SILK]  26.99,8.89 180 bottom
PW+  JUMPER-COMBO_2_NC_TRACE  [COMBO-JUMPER_2_NC_TRACE]  9.84,78.74 90 bottom
PW-  JUMPER-COMBO_2_NC_TRACE  [COMBO-JUMPER_2_NC_TRACE]  7.3,78.74 90 bottom
Q1  [SC70-6]  119.06,20.32 180 top
R1  5.1k  [0603]  135.57,11.43 270 top
R2  5.1k  [0603]  127.95,11.43 270 top
R3  10k  [0603]  109.54,77.47 90 top
R4  10k  [0603]  121.6,20.32 90 top
R5  10k  [0603]  115.25,20.32 270 top
R6  1k  [0603]  35.24,85.22 0 top
R7  1k  [0603]  35.24,83.57 0 top
R8  49.9  [0603]  35.24,78.61 0 top
R9  49.9  [0603]  35.24,80.26 0 top
R10  49.9  [0603]  35.24,75.31 0 top
R11  13k  [0603]  130.49,68.58 180 top
R12  49.9  [0603]  35.24,76.96 0 top
R13  13k  [0603]  41.97,69.47 270 top
R14  13k  [0603]  40.32,69.47 270 top
R15  10k  [0603]  44.01,85.09 90 top
R16  10k  [0603]  129.22,52.83 180 top
R17  10k  [0603]  71.18,16.51 90 top
R18  10k  [0603]  91.12,88.27 90 top
R19  1k  [0603]  129.22,51.18 0 top
R20  4.7k  [0603]  37.02,69.47 270 top
R21  4.7k  [0603]  131.89,59.69 270 top
R22  10k  [0603]  42.35,85.09 270 top
R23  10k  [0603]  58.1,86.11 180 top
R24  13k  [0603]  130.49,66.93 180 top
R25  1k  [0603]  131.25,73.66 270 top
R26  1k  [0603]  132.91,73.66 270 top
R27  1k  [0603]  52.39,12.7 180 top
R28  1k  [0603]  18.73,12.7 0 top
R29  10k  [0603]  139.64,59.69 270 top
R30  33  [0603]  135.19,59.69 90 top
R31  33  [0603]  133.54,59.69 90 top
R32  33  [0603]  136.84,59.69 90 top
R33  5.1k  [0603]  115.25,11.43 270 top
R34  5.1k  [0603]  107.63,11.43 270 top
R35  49.9  [0603]  142.81,73.66 270 top
R36  1k  [0603]  10.48,12.7 0 top
R37  1k  [0603]  43.5,12.7 0 top
R38  1k  [0603]  26.99,12.7 0 top
R39  1k  [0603]  35.24,12.7 0 top
R40  49.9  [0603]  141.16,73.66 270 top
R41  49.9  [0603]  139.51,73.66 270 top
R42  49.9  [0603]  137.86,73.66 270 top
R43  10k  [0603]  58.1,89.41 0 top
R44  10k  [0603]  58.1,87.76 0 top
R45  49.9 1/2W  [1206]  42.74,56.01 270 top
R46  10k  [0603]  69.53,16.51 90 top
R47  10k  [0603]  61.28,16.51 90 top
R48  10k  [0603]  129.22,49.53 0 top
R49  10k  [0603]  129.22,56.13 0 top
R50  10k  [0603]  103.82,50.8 180 top
R51  0  [0603]  129.22,54.48 0 top
R52  0  [0603]  129.22,47.88 0 top
R_SCL  2.2k  [0603]  86.04,16.51 90 top
R_SDA  2.2k  [0603]  93.66,16.51 90 top
RDY  TEST-POINTPOGO_PTH  [1X01_NO_SILK]  79.69,52.07 90 top
REF  TEST-POINTPOGO_PTH  [1X01_NO_SILK]  74.61,87.63 90 top
RESET  MOMENTARY-SWITCH-SPST-PTH-RIGHT-ANGLE-8-020  [TACTILE_SWITCH_PTH_RA_8-020]  121.6,3.81 0 top
RESET_SW  JUMPER-SMT_2_NC_TRACE_SILK  [SMT-JUMPER_2_NC_TRACE_SILK]  121.6,8.89 270 bottom
RTK  JUMPER-SMT_2_NC_TRACE_SILK  [SMT-JUMPER_2_NC_TRACE_SILK]  35.24,8.89 180 bottom
RTS  TEST-POINTPOGO_PTH  [1X01_NO_SILK]  119.06,16.51 0 top
RX  TEST-POINTPOGO_PTH  [1X01_NO_SILK]  126.68,15.24 0 top
SCL2  TEST-POINTPOGO_PTH  [1X01_NO_SILK]  84.77,11.43 0 top
SDA2  TEST-POINTPOGO_PTH  [1X01_NO_SILK]  94.93,11.43 0 top
SHLD1  JUMPER-SMT_2_NC_TRACE_SILK  [SMT-JUMPER_2_NC_TRACE_SILK]  131.76,3.17 270 bottom
SHLD2  JUMPER-SMT_2_NC_TRACE_SILK  [SMT-JUMPER_2_NC_TRACE_SILK]  111.44,3.17 270 bottom
TP_BOOT  TEST-POINTPOGO_PTH  [1X01_NO_SILK]  141.92,12.7 0 top
TX  TEST-POINTPOGO_PTH  [1X01_NO_SILK]  129.22,15.24 0 top
U1  ESP32-WROVER-IE  [ESP32-WROVER-E/IE]  116.52,59.69 90 top
U2  CH340C  [SO016]  130.49,20.32 0 top
U3  XC6222B331MR-G  [SOT23-5]  70.8,43.18 270 top
U4  TXS0108  [VFQFN-20]  53.02,87.63 0 top
U5  TXS0108  [VFQFN-20]  108.9,87.63 0 top
U6  XC6222B331MR-G  [SOT23-5]  70.8,38.1 270 top
U7  KSZ8041NL  [MLF55Q-32LD]  136.84,66.04 270 top
U8  MOSAIC-X5X5  [MOSAIC_LGA]  79.69,69.85 270 top
U9  KSZ8041NL  [MLF55Q-32LD]  41.59,78.74 0 top
U10  POE_PSU-DP990X  [DP990X]  18.73,63.5 90 top
U11  SN74AVC4T774PW  [SOP65P640X120-16N]  54.04,80.01 90 top
U17  URB2405YMD  [URB_YMD-15WR3]  26.35,36.83 0 top
U$2  [#ACT#0]  10.35,98.42 0 bottom
U$3  [#SHLD#0]  112.08,3.17 0 bottom
U$4  [#LINK#1]  21.15,98.42 0 bottom
U$5  [PW#0]  5.4,76.58 90 top
U$6  [PW#1]  11.75,76.58 90 top
U$7  [##RESET##5]  122.36,8.89 0 bottom
U$8  [#BT#0]  11.37,8.89 0 bottom
U$9  [#ACT#0]  132.4,98.42 0 bottom
U$10  [#LINK#1]  143.07,98.42 0 bottom
U$11  [#LOG#4]  44.39,8.89 0 bottom
U$12  [#PVT#2]  27.88,8.89 0 bottom
U$13  [#RTK#3]  36.13,8.89 0 bottom
U$14  [#WIFI#1]  19.62,8.89 0 bottom
U$15  [#BOOT#6]  142.68,8.89 0 bottom
U$16  [#_______________MOSAIC_X5_______________#8]  41.21,99.06 0 bottom
U$17  [#RX#2]  42.48,89.41 270 bottom
U$18  [#TX#3]  46.04,89.28 270 bottom
U$19  [#RTS#4]  49.59,88.52 270 bottom
U$20  [#CTS#5]  53.02,88.39 270 bottom
U$21  [ESP32_WIFI_#_BT0]  77.15,101.6 90 top
U$22  [#EVENT_A#6]  56.58,84.71 270 bottom
U$23  [#EVENT_B#7]  60.01,84.96 270 bottom
U$24  [VCCA0]  141.29,62.23 0 top
U$25  [#GND#0]  35.37,88.39 270 bottom
U$26  [#VCCIO#1]  38.93,86.74 270 bottom
U$27  [#VCCIO#1]  120.08,86.74 270 bottom
U$28  [#GND#0]  123.38,88.39 270 bottom
U$29  [#RTS#4]  105.98,88.65 270 bottom
U$30  [#CTS#5]  109.54,88.52 270 bottom
U$31  [#RX#2]  99,89.53 270 bottom
U$32  [#TX#3]  102.55,89.28 270 bottom
U$33  [#PPSO#11]  92.01,87.63 270 bottom
U$34  [#LOG_BTN#33]  95.44,85.09 270 bottom
U$35  [#SCL#10]  112.97,88.39 270 bottom
U$36  [#SDA#9]  116.52,88.14 270 bottom
U$37  [#MOSAIC#8]  89.85,99.06 0 bottom
U$38  [#___________________ESP32___________________#34]  97.98,99.06 0 bottom
U$39  [#3#3V#6]  117.03,83.82 0 top
U$40  [#5V#0]  127.83,83.82 0 top
U$41  [2V8220]  61.66,66.04 0 top
U$42  [2V8220]  57.09,66.04 0 bottom
U$43  [BOOT2]  144.84,14.22 0 top
U$44  [BOOT2]  139,14.22 0 bottom
U$45  [#SHLD#0]  132.4,3.17 0 bottom
U$46  [#I�C#0]  89.85,16.95 0 bottom
U$47  [COM2_CTS219]  101.54,66.04 0 bottom
U$48  [COM2_RTS219]  101.54,63.5 0 bottom
U$49  [COM2_RX219]  90.36,62.23 0 bottom
U$54  [COM2_TX219]  90.23,64.77 0 bottom
U$55  [RTS2231]  116.65,16.51 0 top
U$56  [DTR2232]  116.65,24.13 0 top
U$57  [COM3_CTS18]  89.34,72.39 0 bottom
U$58  [COM3_RTS18]  89.47,69.85 0 bottom
U$59  [3V3_SW25]  86.04,43.18 0 top
U$60  [3V325]  83.25,38.1 0 top
U$61  [5V25]  62.29,46.1 0 top
U$62  [MEAS2]  50.61,52.58 0 top
U$63  [VIN#0]  27.24,87.5 270 bottom
U$64  [COM3_RX219]  90.36,67.31 0 bottom
U$65  [COM3_TX18]  101.54,71.12 0 bottom
U$66  [GPIO17]  104.84,82.55 0 top
U$67  [GPIO17]  99.25,82.55 0 bottom
U$68  [GPIO218]  101.54,68.58 0 bottom
U$69  [RTK_MOSAIC_X50]  75.88,21.59 0 top
U$70  [VIN#0]  27.24,87.63 90 top
U$71  [VIN#1]  33.08,87.5 270 bottom
U$72  [VIN#1]  33.08,87.63 90 top
U$73  [MOSAIC_#RST#6]  82.74,52.2 0 bottom
U$74  [#RESET#0]  86.04,49.53 0 bottom
U$75  [RDY5]  79.57,52.07 0 top
U$76  [RTS2231]  116.52,16.51 0 bottom
U$77  [DTR2232]  116.52,24.13 0 bottom
U$78  [RDY5]  74.99,52.07 0 bottom
U$79  [REF219]  74.36,87.63 0 top
U$80  [REF219]  72.45,86.11 0 bottom
U$81  [V_POE0]  41.85,48.26 0 bottom
U$82  [V_USB3]  41.85,43.18 0 bottom
U$83  [V_USB24]  41.85,45.72 0 bottom
U$84  [MEAS2]  44.89,52.58 0 bottom
U$85  [VIN1]  41.97,40.64 0 bottom
U$86  [5V25]  58.74,46.1 0 bottom
U$87  [3V325]  78.8,38.1 0 bottom
U$88  [3V3_SW25]  78.8,43.18 0 bottom
U$89  [RX0]  126.56,15.24 0 top
U$90  [RX0]  123,15.24 0 bottom
U$91  [SCL3]  86.8,12.95 0 top
U$92  [SCL3]  82.61,12.95 0 bottom
U$93  [SDA4]  97.35,13.08 0 top
U$94  [SDA4]  92.77,13.08 0 bottom
U$95  [TX1]  133.16,15.24 0 top
U$96  [TX1]  129.48,15.24 0 bottom
U$97  [VDDA220]  50.99,68.2 0 top
U$98  [VDDA220]  45.15,66.93 0 bottom
U$99  [RTK_MOSAIC_X50]  75.88,21.59 0 bottom
U$100  [MOSAIC_X50]  64.45,101.6 90 top
U$101  [1V80]  88.46,87.63 0 top
U$102  [1V80]  86.3,86.11 0 bottom
U$103  [BLUE0]  10.48,2.54 0 top
U$104  [YELLOW1]  18.73,2.54 0 top
U$105  [BLUE0]  26.99,2.54 0 top
U$106  [BLUE0]  35.24,2.54 0 top
U$107  [VCCA0]  141.16,62.23 0 bottom
U$108  [GREEN2]  43.5,2.54 0 top
U$113  [PW#0]  5.4,80.9 270 bottom
U$114  [PW#1]  11.75,81.03 270 bottom
U$135  [GND12]  46.55,33.53 0 bottom
U$136  [POE_LOAD0]  31.43,50.8 0 top
U$143  [GND12]  46.67,33.53 0 top
U$146  [HIGH_TEMP_WARNING]  44.13,62.23 0 top
U$147  [HIGH_TEMP_WARNING]  32.19,63.88 0 top
U$152  [RTK5#SVG0]  91.12,24.89 0 top
U$153  [RTK5#SVG0]  60.64,25.02 0 bottom
VCCA  TEST-POINTPOGO_PTH  [1X01_NO_SILK]  144.46,62.23 0 top
VCCIO  [SWITCH_DPDT_SMD_AYZ0202]  120.33,83.82 0 top
VDDA  TEST-POINTPOGO_PTH  [1X01_NO_SILK]  47.94,68.58 0 top
VIN  TEST-POINTPOGO_PTH  [1X01_NO_SILK]  41.59,40.64 0 top
VIN+  JUMPER-COMBO_2_NC_TRACE  [COMBO-JUMPER_2_NC_TRACE]  28.89,87.63 90 bottom
VIN-  JUMPER-COMBO_2_NC_TRACE  [COMBO-JUMPER_2_NC_TRACE]  31.43,87.63 270 bottom
VPOE  TEST-POINTPOGO_PTH  [1X01_NO_SILK]  41.59,48.26 0 top
VUSB  TEST-POINTPOGO_PTH  [1X01_NO_SILK]  41.59,43.18 0 top
VUSB2  TEST-POINTPOGO_PTH  [1X01_NO_SILK]  41.59,45.72 0 top
WIFI  JUMPER-SMT_2_NC_TRACE_SILK  [SMT-JUMPER_2_NC_TRACE_SILK]  18.73,8.89 180 bottom